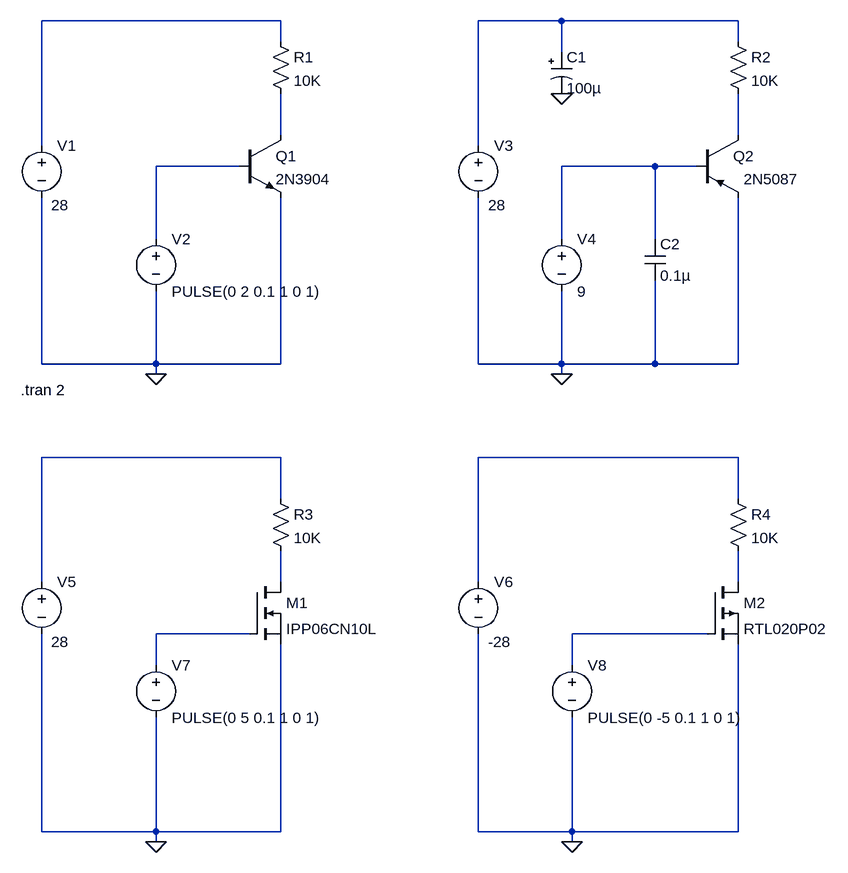
[diagram p0: schematic PNP_NPN.asc]
PNP_NPN.asc, the LTspice schematic file:
Version 4
SHEET 1 1584 1204
WIRE 384 -96 16 -96
WIRE 816 -96 688 -96
WIRE 1088 -96 816 -96
WIRE 384 -64 384 -96
WIRE 1088 -64 1088 -96
WIRE 816 -48 816 -96
WIRE 384 80 384 16
WIRE 1088 80 1088 16
WIRE 16 96 16 -96
WIRE 688 96 688 -96
WIRE 320 128 192 128
WIRE 960 128 816 128
WIRE 1024 128 960 128
WIRE 192 240 192 128
WIRE 816 240 816 128
WIRE 960 240 960 128
WIRE 16 432 16 176
WIRE 192 432 192 320
WIRE 192 432 16 432
WIRE 384 432 384 176
WIRE 384 432 192 432
WIRE 688 432 688 176
WIRE 816 432 816 320
WIRE 816 432 688 432
WIRE 960 432 960 304
WIRE 960 432 816 432
WIRE 1088 432 1088 176
WIRE 1088 432 960 432
WIRE 192 448 192 432
WIRE 816 448 816 432
WIRE 384 576 16 576
WIRE 1088 576 688 576
WIRE 384 640 384 576
WIRE 1088 640 1088 576
WIRE 16 768 16 576
WIRE 384 768 384 720
WIRE 688 768 688 576
WIRE 1088 768 1088 720
WIRE 336 848 192 848
WIRE 1040 848 832 848
WIRE 192 896 192 848
WIRE 832 896 832 848
WIRE 16 1152 16 848
WIRE 192 1152 192 976
WIRE 192 1152 16 1152
WIRE 384 1152 384 864
WIRE 384 1152 192 1152
WIRE 688 1152 688 848
WIRE 832 1152 832 976
WIRE 832 1152 688 1152
WIRE 1088 1152 1088 864
WIRE 1088 1152 832 1152
WIRE 192 1168 192 1152
WIRE 832 1168 832 1152
FLAG 192 448 0
FLAG 816 448 0
FLAG 816 16 0
FLAG 192 1168 0
FLAG 832 1168 0
SYMBOL voltage 16 80 R0
WINDOW 3 15 108 Left 2
WINDOW 123 0 0 Left 0
WINDOW 39 0 0 Left 0
SYMATTR Value 28
SYMATTR InstName V1
SYMBOL npn 320 80 R0
SYMATTR InstName Q1
SYMATTR Value 2N3904
SYMBOL pnp 1024 80 R0
WINDOW 3 72 68 Left 2
SYMATTR Value 2N5087
SYMATTR InstName Q2
SYMBOL voltage 192 224 R0
WINDOW 3 24 97 Left 2
WINDOW 123 0 0 Left 0
WINDOW 39 0 0 Left 0
SYMATTR Value PULSE(0 2 0.1 1 0 1)
SYMATTR InstName V2
SYMBOL res 368 -80 R0
SYMATTR InstName R1
SYMATTR Value 10K
SYMATTR SpiceLine tol=1 pwr=0.1
SYMBOL voltage 688 80 R0
WINDOW 3 15 108 Left 2
WINDOW 123 0 0 Left 0
WINDOW 39 0 0 Left 0
SYMATTR Value 28
SYMATTR InstName V3
SYMBOL voltage 816 224 R0
WINDOW 3 24 97 Left 2
WINDOW 123 0 0 Left 0
WINDOW 39 0 0 Left 0
SYMATTR Value 9
SYMATTR InstName V4
SYMBOL res 1072 -80 R0
SYMATTR InstName R2
SYMATTR Value 10K
SYMATTR SpiceLine tol=1 pwr=0.1
SYMBOL polcap 800 -48 R0
WINDOW 3 24 56 Left 2
SYMATTR Value 100µ
SYMATTR InstName C1
SYMATTR Description Capacitor
SYMATTR Type cap
SYMATTR SpiceLine V=35 Irms=450m Rser=0.082 Lser=5.49363n mfg="Würth Elektronik" pn="860040573004 WCAP-ATUL 6,3x11" type="Al electrolytic"
SYMBOL cap 944 240 R0
SYMATTR InstName C2
SYMATTR Value 0.1µ
SYMATTR SpiceLine V=50 Irms=0 Rser=0.0488383 Lser=600p mfg="Würth Elektronik" pn="885012205086 WCAP-CSGP 0402" type="X7R"
SYMBOL nmos 336 768 R0
SYMATTR InstName M1
SYMATTR Value IPP06CN10L
SYMBOL pmos 1040 768 R0
SYMATTR InstName M2
SYMATTR Value RTL020P02
SYMBOL voltage 16 752 R0
WINDOW 3 15 108 Left 2
WINDOW 123 0 0 Left 0
WINDOW 39 0 0 Left 0
SYMATTR Value 28
SYMATTR InstName V5
SYMBOL voltage 688 752 R0
WINDOW 3 15 108 Left 2
WINDOW 123 0 0 Left 0
WINDOW 39 0 0 Left 0
SYMATTR Value -28
SYMATTR InstName V6
SYMBOL voltage 192 880 R0
WINDOW 3 24 97 Left 2
WINDOW 123 0 0 Left 0
WINDOW 39 0 0 Left 0
SYMATTR Value PULSE(0 5 0.1 1 0 1)
SYMATTR InstName V7
SYMBOL voltage 832 880 R0
WINDOW 3 24 97 Left 2
WINDOW 123 0 0 Left 0
WINDOW 39 0 0 Left 0
SYMATTR Value PULSE(0 -5 0.1 1 0 1)
SYMATTR InstName V8
SYMBOL res 368 624 R0
SYMATTR InstName R3
SYMATTR Value 10K
SYMATTR SpiceLine tol=1 pwr=0.1
SYMBOL res 1072 624 R0
SYMATTR InstName R4
SYMATTR Value 10K
SYMATTR SpiceLine tol=1 pwr=0.1
TEXT -16 472 Left 2 !.tran 2

The netlist it stands for:
* PNP_NPN.asc
V1 N001 0 28
Q1 N003 N005 0 0 2N3904
Q2 N004 N006 0 0 2N5087
V2 N005 0 PULSE(0 2 0.1 1 0 1)
R1 N001 N003 10K tol=1 pwr=0.1
V3 N002 0 28
V4 N006 0 9
R2 N002 N004 10K tol=1 pwr=0.1
C1 N002 0 100µ V=35 Irms=450m Rser=0.082 Lser=5.49363n mfg="Würth Elektronik" pn="860040573004 WCAP-ATUL 6,3x11" type="Al electrolytic"
C2 N006 0 0.1µ V=50 Irms=0 Rser=0.0488383 Lser=600p mfg="Würth Elektronik" pn="885012205086 WCAP-CSGP 0402" type="X7R"
M1 N009 N011 0 0 IPP06CN10L
M2 N010 N012 0 0 RTL020P02
V5 N007 0 28
V6 N008 0 -28
V7 N011 0 PULSE(0 5 0.1 1 0 1)
V8 N012 0 PULSE(0 -5 0.1 1 0 1)
R3 N007 N009 10K tol=1 pwr=0.1
R4 N008 N010 10K tol=1 pwr=0.1
.model NPN NPN
.model PNP PNP
.lib standard.bjt
.model NMOS NMOS
.model PMOS PMOS
.lib standard.mos
.tran 2
.backanno
.end